# Altium schematic sheet c8t61.SchDoc
size A4
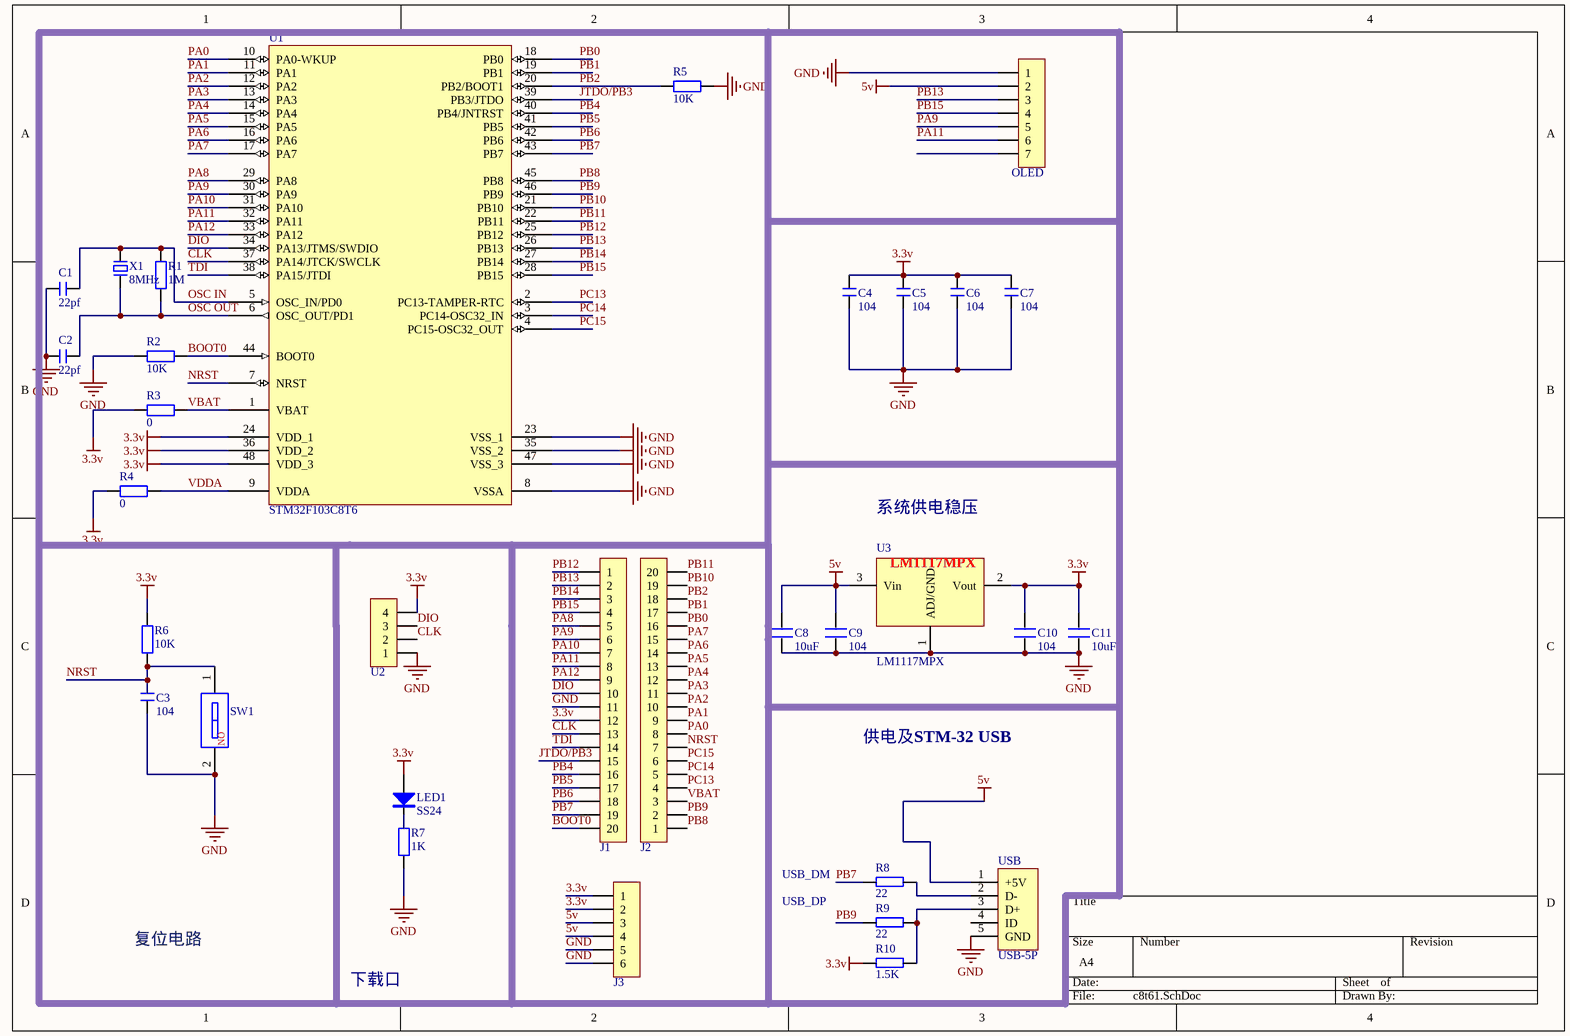
[diagram p0: c8t61.SchDoc]

## Parts
C1  22pf  [C 0603]
C2  22pf  [C 0603]
C3  104  [C 0603]
C4  104  [C 0603]
C5  104  [C 0603]
C6  104  [C 0603]
C7  104  [C 0603]
C8  10uF  [C 0805]
C9  104  [C 0805]
C10  104  [C 0805]
C11  10uF  [C 0805]
J1  HDR-1X20  [HDR-1X20]  (value not drawn)
J2  HDR-1X20  [HDR-1X20]  (value not drawn)
J3  HDR-1X6  [HDR-1X6]  (value not drawn)
LED1  SS24  [LED 1206G]
OLED  HDR-1X7  [HDR-1X7]  (value not drawn)
R1  1M  [R 0603]
R2  10K  [R 0603]
R3  0  [R 0603]
R4  0  [R 0603]
R5  10K  [R 0603]
R6  10K  [R 0603]
R7  1K  [R 0603]
R8  22  [R 0805]
R9  22  [R 0805]
R10  1.5K  [R 0805]
SW1  CSW-1P  [TSW SMD-3*6*5]  (value not drawn)
U1  STM32F103C8T6  [LQFP48 7X7_M]
U2  HDR-1X4  [HDR-1X4]  (value not drawn)
U3  LM1117MPX  [SOT-223-4]
USB  USB-5P  [USB-MICRO_A]
X1  8MHz  [SMD5032-2]

## Nets
3.3v: C4.2 C5.2 C6.2 C7.2 C10.2 C11.2 J1.12 J3.1 J3.2 LED1.1(A) R3.2 R4.1 R6.1 R10.2 U1.24(VDD_1) U1.36(VDD_2) U1.48(VDD_3) U2.4 U3.2(Vout)
5v: C8.2 C9.2 J3.3 J3.4 OLED.2 U3.3(Vin) USB.1(+5V)
GND: C1.1 C2.1 C3.1 C4.1 C5.1 C6.1 C7.1 C8.1 C9.1 C10.1 C11.1 J1.11 J3.5 J3.6 OLED.1 R2.2 R5.1 R7.2 SW1.2 U1.8(VSSA) U1.23(VSS_1) U1.35(VSS_2) U1.47(VSS_3) U2.1 U3.1(ADJ/GND) USB.5(GND)
BOOT0: J1.20 R2.1 U1.44(BOOT0)
CLK: J1.13 U1.37(PA14/JTCK/SWCLK) U2.2
DIO: J1.10 U1.34(PA13/JTMS/SWDIO) U2.3
JTDO/PB3: J1.15 U1.39(PB3/JTDO)
NRST: C3.2 J2.7 R6.2 SW1.1 U1.7(NRST)
OSC IN: C1.2 R1.2 U1.5(OSC_IN/PD0) X1.2
OSC OUT: C2.2 R1.1 U1.6(OSC_OUT/PD1) X1.1
PA0: J2.8 U1.10(PA0-WKUP)
PA1: J2.9 U1.11(PA1)
PA2: J2.10 U1.12(PA2)
PA3: J2.11 U1.13(PA3)
PA4: J2.12 U1.14(PA4)
PA5: J2.13 U1.15(PA5)
PA6: J2.14 U1.16(PA6)
PA7: J2.15 U1.17(PA7)
PA8: J1.5 U1.29(PA8)
PA9: J1.6 OLED.5 U1.30(PA9)
PA10: J1.7 U1.31(PA10)
PA11: J1.8 OLED.6 U1.32(PA11)
PA12: J1.9 U1.33(PA12)
PB0: J2.16 U1.18(PB0)
PB1: J2.17 U1.19(PB1)
PB2: J2.18 R5.2 U1.20(PB2/BOOT1)
PB4: J1.16 U1.40(PB4/JNTRST)
PB5: J1.17 U1.41(PB5)
PB6: J1.18 U1.42(PB6)
PB7: J1.19 R8.2 U1.43(PB7)
PB8: J2.1 U1.45(PB8)
PB9: J2.2 R9.2 U1.46(PB9)
PB10: J2.19 U1.21(PB10)
PB11: J2.20 U1.22(PB11)
PB12: J1.1 U1.25(PB12)
PB13: J1.2 OLED.3 U1.26(PB13)
PB14: J1.3 U1.27(PB14)
PB15: J1.4 OLED.4 U1.28(PB15)
PC13: J2.4 U1.2(PC13-TAMPER-RTC)
PC14: J2.5 U1.3(PC14-OSC32_IN)
PC15: J2.6 U1.4(PC15-OSC32_OUT)
TDI: J1.14 U1.38(PA15/JTDI)
VBAT: J2.3 R3.1 U1.1(VBAT)
VDDA: R4.2 U1.9(VDDA)
NetLED1_2: LED1.2(K) R7.1
NetR8_1: R8.1 USB.2(D-)
NetR9_1: R9.1 R10.1 USB.3(D+)

Not connected (* = marked no-connect by the designer): OLED 7; USB 4(ID)

## Notes on the sheet
- 系统供电稳压
- 供电及STM-32 USB
- USB_DM
- USB_DP
- 复位电路
- 下载口
- (in symbol CSW-1P) NO

## Library data of the parts
C1-C7 = C: 无极性贴片电容; 版权归属: 源创客; BOM名称: 无极性贴片电容; 学习资源: www.ooocke.com
C8-C11 = C
J1 J2 = Header 20: 20P接插件; 版权归属: 源创客; BOM名称: 20P接插件; 学习资源: www.ooocke.com
J3 = Header 6: 6P接插件; 版权归属: 源创客; BOM名称: 6P接插件; 学习资源: www.ooocke.com
LED1 = SS24: 肖特基二极管; 版权归属: 源创客; 属性: 40V/2A; BOM名称: 肖特基二极管; 学习资源: www.ooocke.com
OLED = Header 7: 7P接插件; 版权归属: 源创客; BOM名称: 7P接插件; 学习资源: www.ooocke.com
R1-R7 = R: 贴片电阻; 版权归属: 源创客; BOM名称: 贴片电阻; 学习资源: www.ooocke.com
R8-R10 = R
SW1 = CSW-1P: 2路编码开关; 版权归属: 源创客; BOM名称: 2路编码开关; 学习资源: www.ooocke.com
U1 = STM32F103C8T6: Flaah:64/RAM:20/IO:36; BOM名称: 32位STM单片机; 版权归属: 源创客; 学习资源: www.ooocke.com
U2 = Header 4: 4P接插件; 版权归属: 源创客; BOM名称: 4P接插件; 学习资源: www.ooocke.com
U3 = LM1117MPX: NS 800mA Low-Dropout Linear Regulator
USB = USB-5P: 微型USB母座; 版权归属: 源创客; BOM名称: 微型USB母座; 学习资源: www.ooocke.com
X1 = XTAL-2: 2脚晶振; 版权归属: 源创客; BOM名称: 2脚晶振; 学习资源: www.ooocke.com